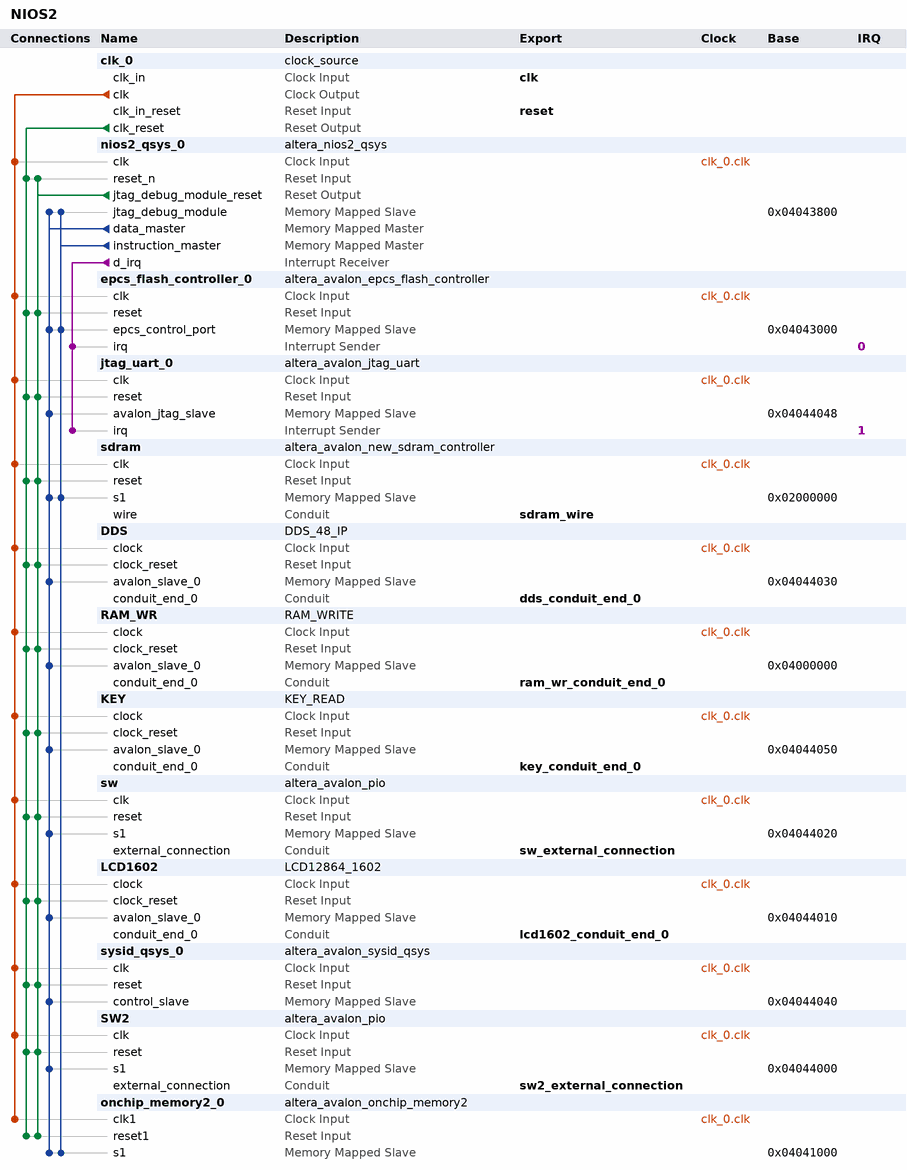
[diagram p0: system contents]
# Platform Designer (Qsys) system NIOS2, Cyclone II EP2C8Q208C8
# Parameters at their usual value, and those the tool derives, are not listed.
package require -exact qsys 13.0.1
create_system NIOS2
set_project_property DEVICE_FAMILY {Cyclone II}
set_project_property DEVICE EP2C8Q208C8

add_instance clk_0 clock_source 13.0
set_instance_parameter_value clk_0 clockFrequency 100000000

add_instance nios2_qsys_0 altera_nios2_qsys 13.0
set_instance_parameter_value nios2_qsys_0 resetSlave epcs_flash_controller_0.epcs_control_port
set_instance_parameter_value nios2_qsys_0 mmu_TLBMissExcSlave None
set_instance_parameter_value nios2_qsys_0 exceptionSlave onchip_memory2_0.s1
set_instance_parameter_value nios2_qsys_0 breakSlave nios2_qsys_0.jtag_debug_module
set_instance_parameter_value nios2_qsys_0 impl Tiny
set_instance_parameter_value nios2_qsys_0 icache_size 4096

add_instance epcs_flash_controller_0 altera_avalon_epcs_flash_controller 13.0.1

add_instance jtag_uart_0 altera_avalon_jtag_uart 13.0.1
set_instance_parameter_value jtag_uart_0 simInteractiveOptions NO_INTERACTIVE_WINDOWS

add_instance sdram altera_avalon_new_sdram_controller 13.0.1
set_instance_parameter_value sdram TAC 5.5
set_instance_parameter_value sdram TRCD 20.0
set_instance_parameter_value sdram TRP 20.0
set_instance_parameter_value sdram casLatency 3
set_instance_parameter_value sdram columnWidth 9
set_instance_parameter_value sdram dataWidth 16
set_instance_parameter_value sdram generateSimulationModel false
set_instance_parameter_value sdram model single_Micron_MT48LC4M32B2_7_chip
set_instance_parameter_value sdram numberOfBanks 4
set_instance_parameter_value sdram numberOfChipSelects 1
set_instance_parameter_value sdram powerUpDelay 100.0
set_instance_parameter_value sdram refreshPeriod 15.625
set_instance_parameter_value sdram rowWidth 13

add_instance DDS DDS_48_IP 1.0
set_instance_parameter_value DDS ROMAD_WIDTH 12

add_instance RAM_WR RAM_WRITE 1.0
set_instance_parameter_value RAM_WR RAM_WIDTH 16

add_instance KEY KEY_READ 1.0
set_instance_parameter_value KEY KEY_WIDTH 4

add_instance sw altera_avalon_pio 13.0.1
set_instance_parameter_value sw direction Input
set_instance_parameter_value sw width 2

add_instance LCD1602 LCD12864_1602 1.0

add_instance sysid_qsys_0 altera_avalon_sysid_qsys 13.0
set_instance_parameter_value sysid_qsys_0 id 0

add_instance SW2 altera_avalon_pio 13.0.1
set_instance_parameter_value SW2 direction Input
set_instance_parameter_value SW2 width 1

add_instance onchip_memory2_0 altera_avalon_onchip_memory2 13.0.1
set_instance_parameter_value onchip_memory2_0 dataWidth 16
set_instance_parameter_value onchip_memory2_0 dualPort false
set_instance_parameter_value onchip_memory2_0 initMemContent true
set_instance_parameter_value onchip_memory2_0 initializationFileName onchip_mem.hex
set_instance_parameter_value onchip_memory2_0 memorySize 4096

# connections
add_connection clk_0.clk DDS.clock clock
add_connection clk_0.clk epcs_flash_controller_0.clk clock
add_connection clk_0.clk jtag_uart_0.clk clock
add_connection clk_0.clk KEY.clock clock
add_connection clk_0.clk LCD1602.clock clock
add_connection clk_0.clk nios2_qsys_0.clk clock
add_connection clk_0.clk onchip_memory2_0.clk1 clock
add_connection clk_0.clk RAM_WR.clock clock
add_connection clk_0.clk sdram.clk clock
add_connection clk_0.clk SW2.clk clock
add_connection clk_0.clk sw.clk clock
add_connection clk_0.clk sysid_qsys_0.clk clock
add_connection clk_0.clk_reset DDS.clock_reset reset
add_connection clk_0.clk_reset epcs_flash_controller_0.reset reset
add_connection clk_0.clk_reset jtag_uart_0.reset reset
add_connection clk_0.clk_reset KEY.clock_reset reset
add_connection clk_0.clk_reset LCD1602.clock_reset reset
add_connection clk_0.clk_reset nios2_qsys_0.reset_n reset
add_connection clk_0.clk_reset onchip_memory2_0.reset1 reset
add_connection clk_0.clk_reset RAM_WR.clock_reset reset
add_connection clk_0.clk_reset sdram.reset reset
add_connection clk_0.clk_reset SW2.reset reset
add_connection clk_0.clk_reset sw.reset reset
add_connection clk_0.clk_reset sysid_qsys_0.reset reset
add_connection nios2_qsys_0.jtag_debug_module_reset DDS.clock_reset reset
add_connection nios2_qsys_0.jtag_debug_module_reset epcs_flash_controller_0.reset reset
add_connection nios2_qsys_0.jtag_debug_module_reset jtag_uart_0.reset reset
add_connection nios2_qsys_0.jtag_debug_module_reset KEY.clock_reset reset
add_connection nios2_qsys_0.jtag_debug_module_reset LCD1602.clock_reset reset
add_connection nios2_qsys_0.jtag_debug_module_reset nios2_qsys_0.reset_n reset
add_connection nios2_qsys_0.jtag_debug_module_reset onchip_memory2_0.reset1 reset
add_connection nios2_qsys_0.jtag_debug_module_reset RAM_WR.clock_reset reset
add_connection nios2_qsys_0.jtag_debug_module_reset sdram.reset reset
add_connection nios2_qsys_0.jtag_debug_module_reset SW2.reset reset
add_connection nios2_qsys_0.jtag_debug_module_reset sw.reset reset
add_connection nios2_qsys_0.jtag_debug_module_reset sysid_qsys_0.reset reset
add_connection nios2_qsys_0.data_master DDS.avalon_slave_0 avalon
set_connection_parameter_value nios2_qsys_0.data_master/DDS.avalon_slave_0 baseAddress 0x04044030
add_connection nios2_qsys_0.data_master epcs_flash_controller_0.epcs_control_port avalon
set_connection_parameter_value nios2_qsys_0.data_master/epcs_flash_controller_0.epcs_control_port baseAddress 0x04043000
add_connection nios2_qsys_0.data_master jtag_uart_0.avalon_jtag_slave avalon
set_connection_parameter_value nios2_qsys_0.data_master/jtag_uart_0.avalon_jtag_slave baseAddress 0x04044048
add_connection nios2_qsys_0.data_master KEY.avalon_slave_0 avalon
set_connection_parameter_value nios2_qsys_0.data_master/KEY.avalon_slave_0 baseAddress 0x04044050
add_connection nios2_qsys_0.data_master LCD1602.avalon_slave_0 avalon
set_connection_parameter_value nios2_qsys_0.data_master/LCD1602.avalon_slave_0 baseAddress 0x04044010
add_connection nios2_qsys_0.data_master nios2_qsys_0.jtag_debug_module avalon
set_connection_parameter_value nios2_qsys_0.data_master/nios2_qsys_0.jtag_debug_module baseAddress 0x04043800
add_connection nios2_qsys_0.data_master onchip_memory2_0.s1 avalon
set_connection_parameter_value nios2_qsys_0.data_master/onchip_memory2_0.s1 baseAddress 0x04041000
add_connection nios2_qsys_0.data_master RAM_WR.avalon_slave_0 avalon
set_connection_parameter_value nios2_qsys_0.data_master/RAM_WR.avalon_slave_0 baseAddress 0x04000000
add_connection nios2_qsys_0.data_master sdram.s1 avalon
set_connection_parameter_value nios2_qsys_0.data_master/sdram.s1 baseAddress 0x02000000
add_connection nios2_qsys_0.data_master SW2.s1 avalon
set_connection_parameter_value nios2_qsys_0.data_master/SW2.s1 baseAddress 0x04044000
add_connection nios2_qsys_0.data_master sw.s1 avalon
set_connection_parameter_value nios2_qsys_0.data_master/sw.s1 baseAddress 0x04044020
add_connection nios2_qsys_0.data_master sysid_qsys_0.control_slave avalon
set_connection_parameter_value nios2_qsys_0.data_master/sysid_qsys_0.control_slave baseAddress 0x04044040
add_connection nios2_qsys_0.instruction_master epcs_flash_controller_0.epcs_control_port avalon
set_connection_parameter_value nios2_qsys_0.instruction_master/epcs_flash_controller_0.epcs_control_port baseAddress 0x04043000
add_connection nios2_qsys_0.instruction_master nios2_qsys_0.jtag_debug_module avalon
set_connection_parameter_value nios2_qsys_0.instruction_master/nios2_qsys_0.jtag_debug_module baseAddress 0x04043800
add_connection nios2_qsys_0.instruction_master onchip_memory2_0.s1 avalon
set_connection_parameter_value nios2_qsys_0.instruction_master/onchip_memory2_0.s1 baseAddress 0x04041000
add_connection nios2_qsys_0.instruction_master sdram.s1 avalon
set_connection_parameter_value nios2_qsys_0.instruction_master/sdram.s1 baseAddress 0x02000000
add_connection nios2_qsys_0.d_irq epcs_flash_controller_0.irq interrupt
set_connection_parameter_value nios2_qsys_0.d_irq/epcs_flash_controller_0.irq irqNumber 0
add_connection nios2_qsys_0.d_irq jtag_uart_0.irq interrupt
set_connection_parameter_value nios2_qsys_0.d_irq/jtag_uart_0.irq irqNumber 1

# exported interfaces
add_interface clk clock sink
set_interface_property clk EXPORT_OF clk_0.clk_in
add_interface lcd1602_conduit_end_0 conduit end
set_interface_property lcd1602_conduit_end_0 EXPORT_OF LCD1602.conduit_end_0
add_interface sw_external_connection conduit end
set_interface_property sw_external_connection EXPORT_OF sw.external_connection
add_interface key_conduit_end_0 conduit end
set_interface_property key_conduit_end_0 EXPORT_OF KEY.conduit_end_0
add_interface ram_wr_conduit_end_0 conduit end
set_interface_property ram_wr_conduit_end_0 EXPORT_OF RAM_WR.conduit_end_0
add_interface dds_conduit_end_0 conduit end
set_interface_property dds_conduit_end_0 EXPORT_OF DDS.conduit_end_0
add_interface sdram_wire conduit end
set_interface_property sdram_wire EXPORT_OF sdram.wire
add_interface reset reset sink
set_interface_property reset EXPORT_OF clk_0.clk_in_reset
add_interface sw2_external_connection conduit end
set_interface_property sw2_external_connection EXPORT_OF SW2.external_connection

set_interconnect_requirement {$system} qsys_mm.clockCrossingAdapter HANDSHAKE
set_interconnect_requirement {$system} qsys_mm.maxAdditionalLatency 1

save_system NIOS2.qsys
